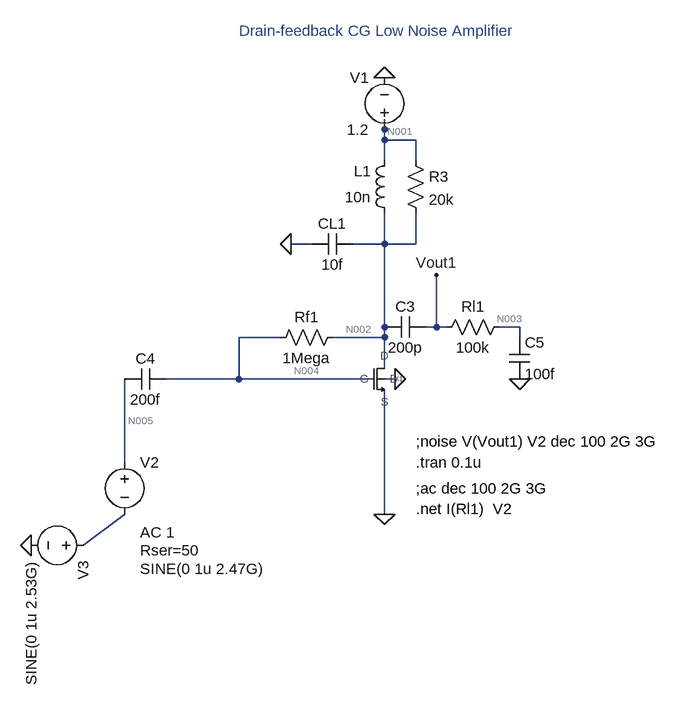
[diagram p0: schematic final_lna.asc]
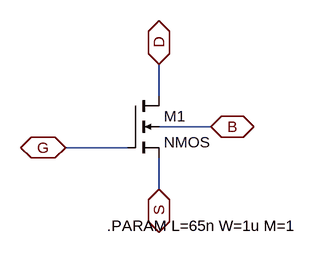
[diagram p1: sub-circuit nmos65.asc]
final_lna.asc, the LTspice schematic file:
Version 4
SHEET 1 1108 792
WIRE 208 -80 208 -96
WIRE 208 -64 208 -80
WIRE 256 -64 208 -64
WIRE 208 -32 208 -64
WIRE 256 -32 256 -64
WIRE 96 96 64 96
WIRE 208 96 208 48
WIRE 208 96 160 96
WIRE 256 96 256 48
WIRE 256 96 208 96
WIRE 208 224 208 96
WIRE 288 224 288 144
WIRE 288 224 272 224
WIRE 304 224 288 224
WIRE 416 224 384 224
WIRE 48 240 -16 240
WIRE 208 240 208 224
WIRE 208 240 128 240
WIRE 416 240 416 224
WIRE 208 288 208 240
WIRE -16 304 -16 240
WIRE -16 304 -128 304
WIRE 192 304 -16 304
WIRE 224 304 208 304
WIRE -192 432 -192 304
WIRE 208 512 208 320
WIRE -256 560 -192 512
FLAG 224 304 0
FLAG 208 -160 0
FLAG 208 512 0
FLAG 288 144 Vout1
FLAG 64 96 0
FLAG 416 304 0
FLAG -336 560 0
SYMBOL nmos65 224 304 R0
WINDOW 0 0 0 Left 0
SYMATTR InstName X1
SYMATTR Value L=65nm, W=100um, M=10
SYMBOL voltage 208 -64 R180
WINDOW 0 24 96 Left 2
WINDOW 3 24 16 Left 2
WINDOW 123 0 0 Left 0
WINDOW 39 0 0 Left 0
SYMATTR InstName V1
SYMATTR Value 1.2
SYMBOL cap 272 208 R90
WINDOW 0 0 32 VBottom 2
WINDOW 3 32 32 VTop 2
SYMATTR InstName C3
SYMATTR Value 200p
SYMBOL res 400 208 R90
WINDOW 0 0 56 VBottom 2
WINDOW 3 32 56 VTop 2
SYMATTR InstName Rl1
SYMATTR Value 100k
SYMBOL cap -128 288 R90
WINDOW 0 0 32 VBottom 2
WINDOW 3 32 32 VTop 2
SYMATTR InstName C4
SYMATTR Value 200f
SYMBOL res 144 224 R90
WINDOW 0 0 56 VBottom 2
WINDOW 3 32 56 VTop 2
SYMATTR InstName Rf1
SYMATTR Value 1Mega
SYMBOL ind 224 64 R180
WINDOW 0 36 80 Left 2
WINDOW 3 36 40 Left 2
SYMATTR InstName L1
SYMATTR Value 10n
SYMATTR SpiceLine Rser=1.57k
SYMBOL cap 160 80 R90
WINDOW 0 0 32 VBottom 2
WINDOW 3 32 32 VTop 2
SYMATTR InstName CL1
SYMATTR Value 10f
SYMBOL cap 400 240 R0
SYMATTR InstName C5
SYMATTR Value 100f
SYMBOL voltage -192 416 R0
WINDOW 3 24 180 Left 2
WINDOW 123 24 124 Left 2
WINDOW 39 24 152 Left 2
SYMATTR InstName V2
SYMATTR Value SINE(0 1u 2.47G)
SYMATTR Value2 AC 1
SYMATTR SpiceLine Rser=50
SYMBOL res 240 -48 R0
SYMATTR InstName R3
SYMATTR Value 20k
SYMBOL voltage -240 560 R90
WINDOW 123 0 0 Left 0
WINDOW 39 0 0 Left 0
SYMATTR InstName V3
SYMATTR Value SINE(0 1u 2.53G)
TEXT 256 472 Left 2 !;ac dec 100 2G 3G
TEXT 256 432 Left 2 !.tran 0.1u
TEXT 256 400 Left 2 !;noise V(Vout1) V2 dec 100 2G 3G
TEXT 256 504 Left 2 !.net I(Rl1)  V2
TEXT -16 -232 Left 2 ;Drain-feedback CG Low Noise Amplifier

nmos65.asc, the sub-circuit schematic file:
Version 4
SHEET 1 880 680
WIRE 160 144 160 96
WIRE 240 192 160 192
WIRE 112 224 16 224
WIRE 160 288 160 240
FLAG 16 224 G
IOPIN 16 224 BiDir
FLAG 160 96 D
IOPIN 160 96 BiDir
FLAG 160 288 S
IOPIN 160 288 BiDir
FLAG 240 192 B
IOPIN 240 192 BiDir
SYMBOL nmos4 112 144 R0
SYMATTR InstName M1
SYMATTR Value2 l={L} w={W} ad='2*65n*{W}' as='2*65n*{W}' pd='2*(2*65n+{W})' ps='2*(2*65n+{W})' m={M}
TEXT 80 344 Left 2 !.PARAM L=65n W=1u M=1

The netlist it stands for:
* final_lna.asc
XX1 N004 N002 0 0 nmos65 params: L=65nm, W=100um, M=10
V1 N001 0 1.2
C3 Vout1 N002 200p
Rl1 N003 Vout1 100k
C4 N004 N005 200f
Rf1 N002 N004 1Mega
L1 N002 N001 10n Rser=1.57k
CL1 N002 0 10f
C5 N003 0 100f
V2 N005 N006 SINE(0 1u 2.47G) AC 1 Rser=50
R3 N001 N002 20k
V3 N006 0 SINE(0 1u 2.53G)

* block symbol definitions
.subckt nmos65 G D S B
M1 D G S B NMOS l={L} w={W} ad='2*65n*{W}' as='2*65n*{W}' pd='2*(2*65n+{W})' ps='2*(2*65n+{W})' m={M}
.PARAM L=65n W=1u M=1
.ends nmos65

.model NMOS NMOS
.model PMOS PMOS
.lib standard.mos
;ac dec 100 2G 3G
.tran 0.1u
;noise V(Vout1) V2 dec 100 2G 3G
.net I(Rl1)  V2
* Drain-feedback CG Low Noise Amplifier
.backanno
.end

* Results of the author's LTspice run, read from the files saved beside the schematic
* Operating Point, zero values left out:
*   V(n002) = 75.83 mV
*   V(n004) = 75.83 mV
*   V(n001) = 1.2 V
*   I(L1) = -828.4 µA
*   I(R3) = 56.21 µA
*   I(V1) = -884.7 µA
*   Ix(x1:D) = 884.7 µA
*   Ix(x1:S) = -884.7 µA
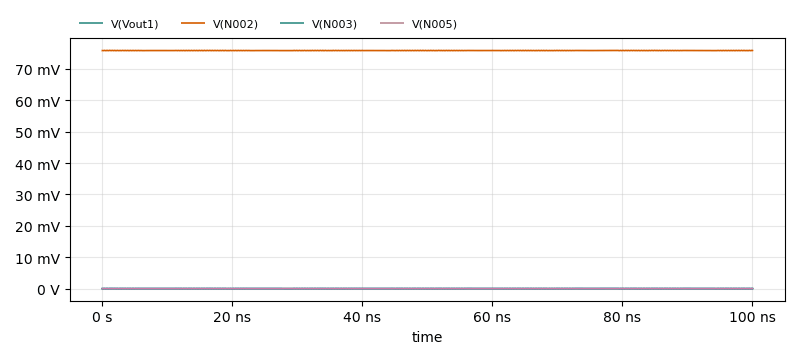
[diagram p2: Transient Analysis of final_lna.asc, plotted from the saved traces]
* Transient Analysis, 1 run:
*   V(Vout1): min -57.37 µV, max 57.85 µV, average 68.98 nV, rms 28.32 µV, last 6.279 µV
*   V(N002): min 75.77 mV, max 75.89 mV, average 75.83 mV, rms 75.83 mV, last 75.84 mV
*   V(N003): min -684.1 nV, max 372.7 nV, average -16.76 nV, rms 188.2 nV, last 372.7 nV
*   V(N005): min -1.994 µV, max 1.984 µV, average -1.695 nV, rms 981.7 nV, last 313.2 pV